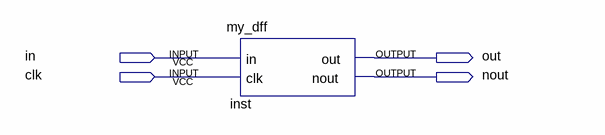
[diagram p0: schematic sheet]
// Quartus schematic flip_flop_testbench_bdf.bdf as structural Verilog: 1 symbols, 4 pins
module flip_flop_testbench_bdf (
  input  in,
  input  clk,
  output out,
  output nout
);

  my_dff inst (.in(in), .clk(clk), .out(out), .nout(nout));
endmodule
